# EasyEDA Pro project STM32单片机最小系统板2024-08-02.eprj

# Schematic Schematic1
Create Date: 2024-08-02; Page Name: P1; Project Name: STM32单片机最小系统板2024-08-02; Schematic Name: Schematic1; Update Date: 2024-08-03; Company: 嘉立创EDA; Page Size: A4; Version: V1.0
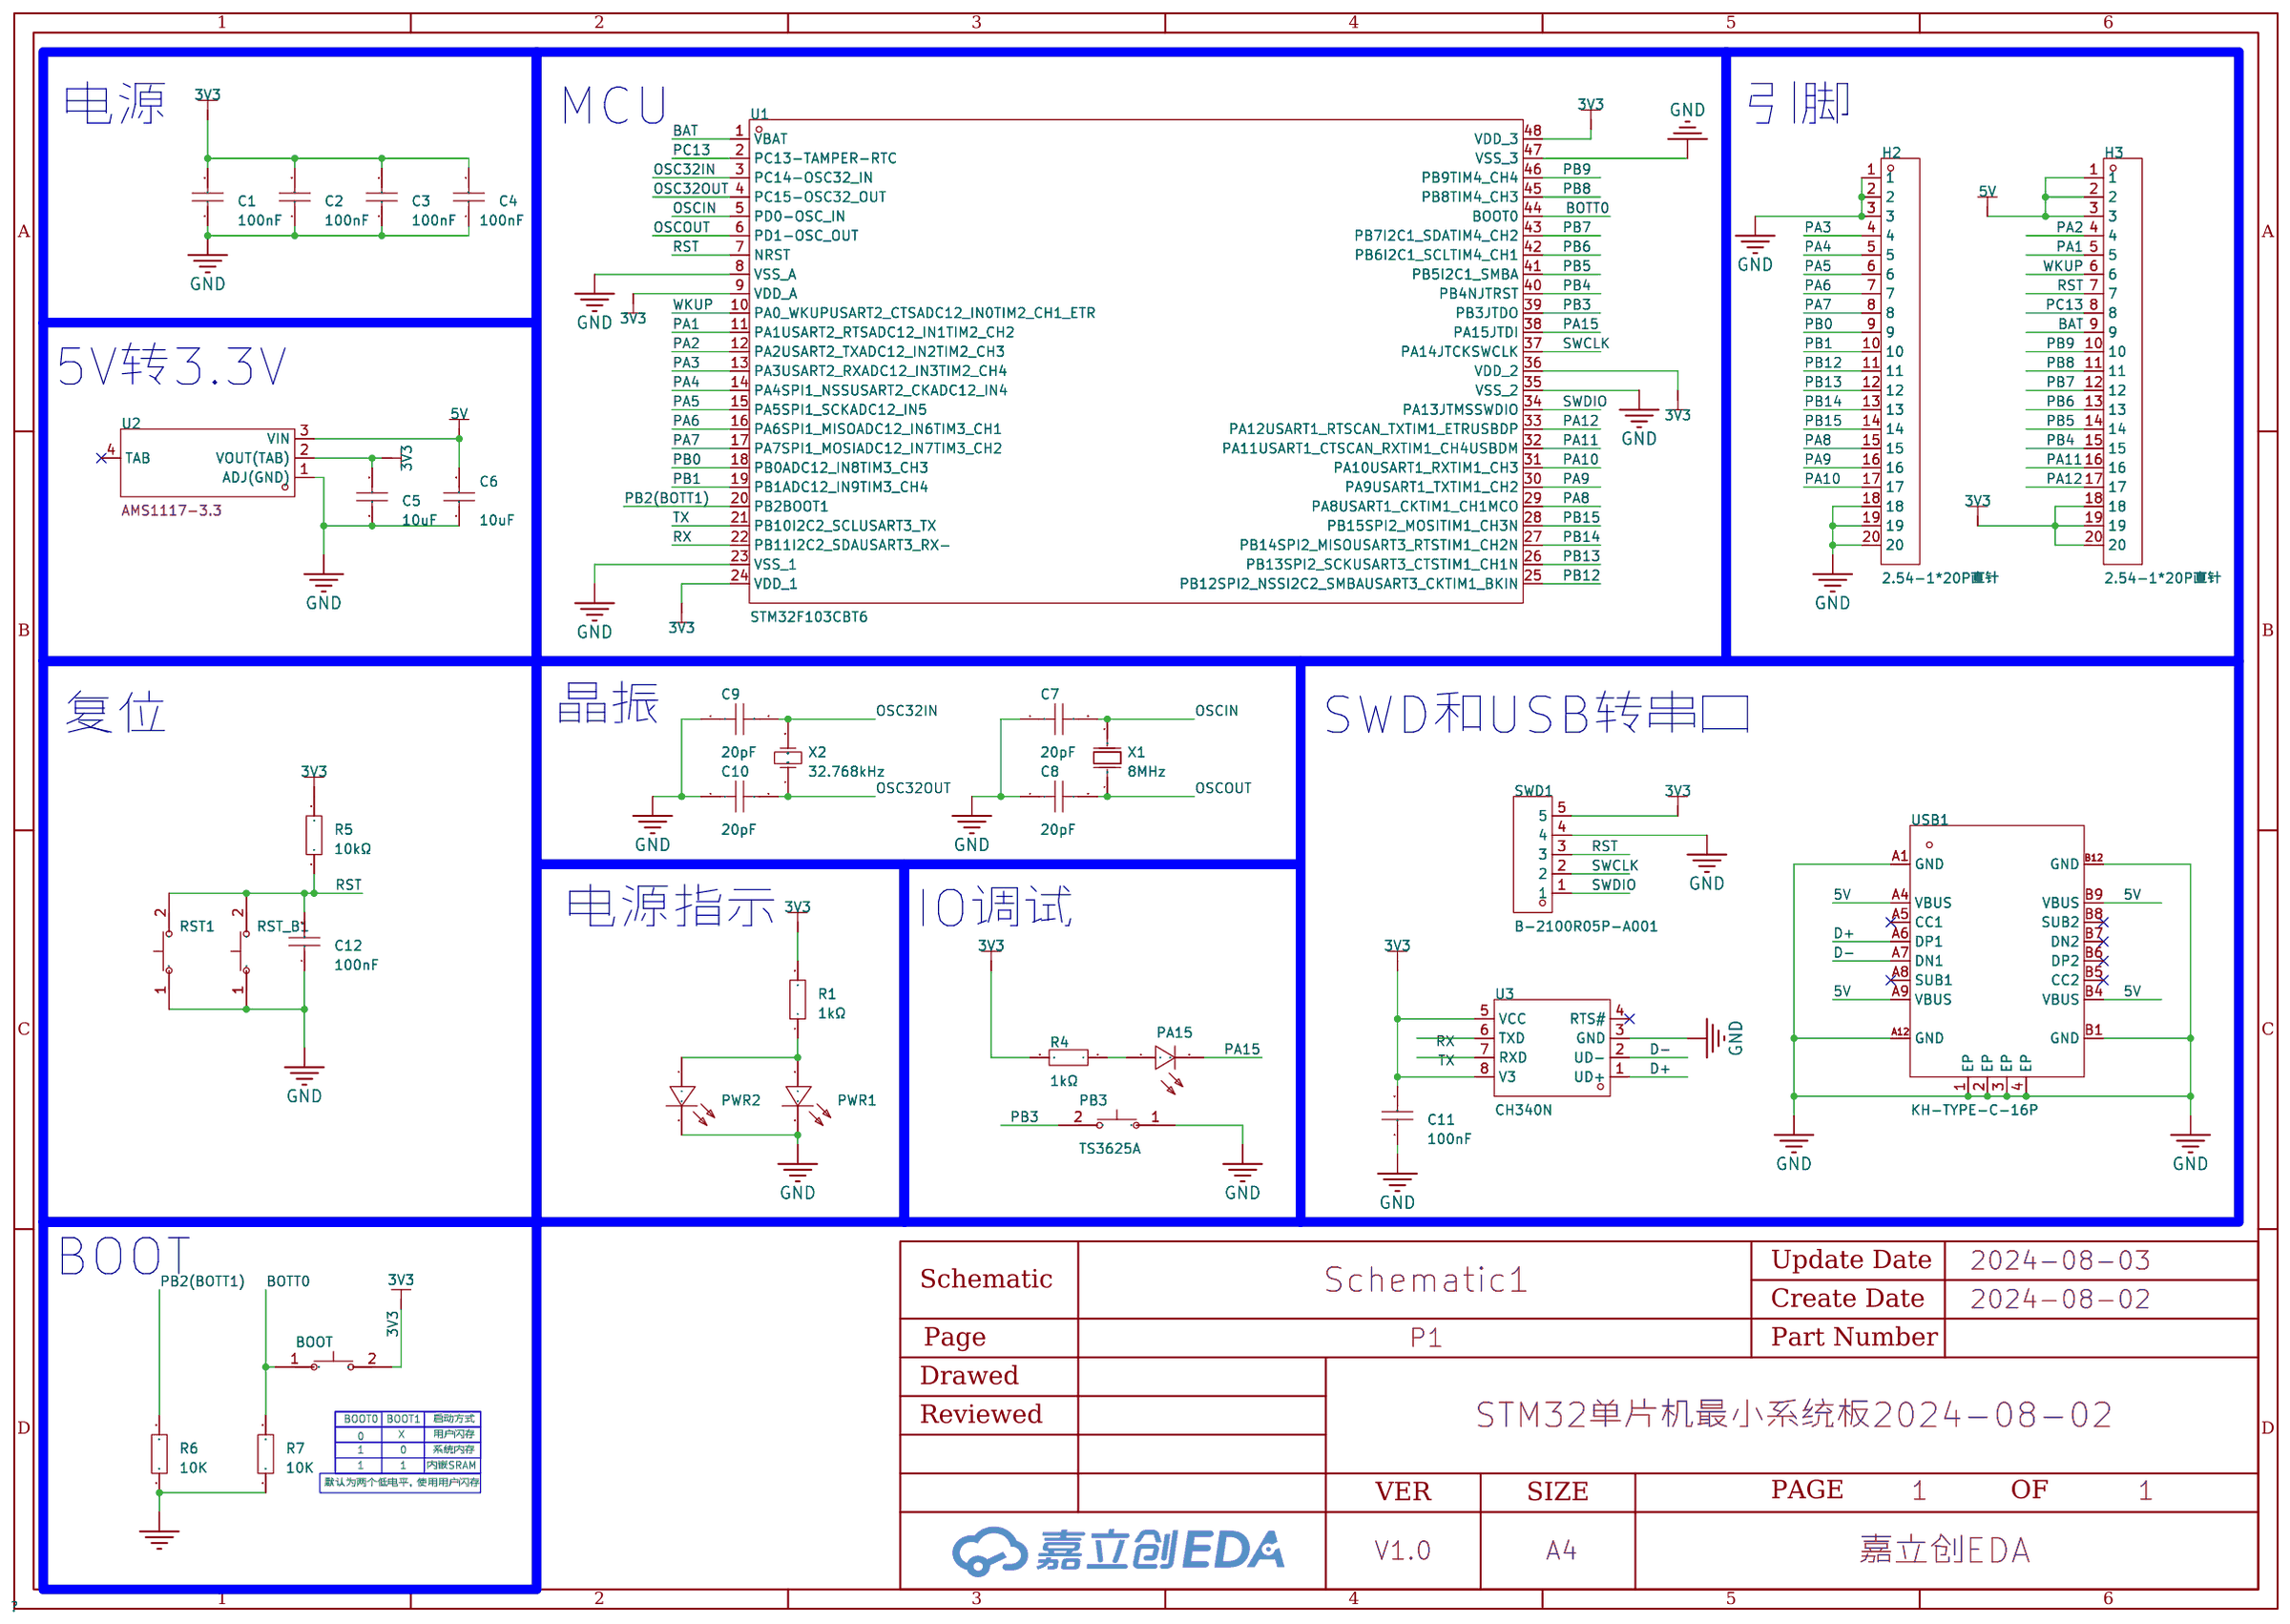
[diagram p0: schematic sheet]

## Parts
BOOT  TS3625A  [KEY-SMD_L6.0-W3.5-LS8.4]
C1  100nF  [C0805]
C2  100nF  [C0805]
C3  100nF  [C0805]
C4  100nF  [C0805]
C5  10uF  [C0805]
C6  10uF  [C0805]
C7  20pF  [C0805]
C8  20pF  [C0805]
C9  20pF  [C0805]
C10  20pF  [C0805]
C11  100nF  [C0805]
C12  100nF  [C0805]
H2  2.54-1*20P直针  [HDR-TH_20P-P2.54-V-M-1]
H3  2.54-1*20P直针  [HDR-TH_20P-P2.54-V-M-1]
PA15  NCD0805G1  [LED0805-R-RD]
PB3  TS3625A  [KEY-SMD_L6.0-W3.5-LS8.4]
PWR1  NCD0805G1  [LED0805-R-RD]
PWR2  NCD0805G1  [LED0805-R-RD]
R1  1kΩ  [R0805]
R4  1kΩ  [R0805]
R5  10kΩ  [R0805]
R6  10K  [R0603]
R7  10K  [R0603]
RST1  TS3625A  [KEY-SMD_L6.0-W3.5-LS8.4]
RST_B1  TS3625A  [KEY-SMD_L6.0-W3.5-LS8.4]
SWD1  B-2100R05P-A001  [HDR-TH_5P-P2.54-H-M-W6.0]
U1  STM32F103CBT6  [LQFP-48_L7.0-W7.0-P0.50-LS9.0-BL]
U2  AMS1117-3.3  [SOT-223-3_L6.5-W3.4-P2.30-LS7.0-BR]
U3  CH340N  [SOP-8_L4.9-W3.9-P1.27-LS6.0-BL]
USB1  KH-TYPE-C-16P  [USB-C-SMD_KH-TYPE-C-16P]
X1  8MHz  [OSC-SMD_4P-L3.2-W2.5-BL]
X2  32.768kHz  [FC-135R_L3.2-W1.5]

## Library data of the parts
BOOT PB3 RST1 RST_B1 = TS3625A: 触点电流:50mA;额定电压(DC):12V;电路结构:单刀单掷;安装方式:立贴;按钮形状:矩形按钮;带灯:-;作用力:250gf@±50gf;开关长度:6.1mm;开关宽度:3.65mm;开关高度:2.5mm;; LCSC Part Name: 轻触开关 3*6*2.5mm 250gf 拉伸款; Supplier Part: C398053; Manufacturer: SHOU HAN(首韩); Supplier Footprint: SMD; JLCPCB Part Class: Extended Part; Datasheet: https://atta.szlcsc.com/upload/public/pdf/source/20190620/C398053_EFFFB524A3F966B1F45EE8333D1EDECC.pdf; Supplier: LCSC; Contact Current: 50mA; Voltage Rating (DC): 12V; Circuit: 单刀单掷; Mounting Style: 立贴; Actuator Style: 矩形按钮; Operating Force: 250gf@±50gf; Switch Length: 6.1mm; Switch Width: 3.65mm; Switch Height: 2.5mm
C1-C4 C11 C12 = 0805B104K500NT: 温度系数:X7R;容值:100nF;精度:±10%;额定电压:50V;; LCSC Part Name: 100nF ±10% 50V; Supplier Part: C38141; Manufacturer: FH(风华); Supplier Footprint: 0805; JLCPCB Part Class: Extended Part; Datasheet: https://atta.szlcsc.com/upload/public/pdf/source/20170923/C38141_1506149447419988747.pdf; Supplier: LCSC; Temperature Coefficient: X7R; Tolerance: ±10%; Voltage Rated: 50V
C5 C6 = 0805X106K250NT: 容值:10uF;精度:±10%;额定电压:25V;材质(温度系数):X5R;; LCSC Part Name: 10uF ±10% 25V; Supplier Part: C40894; Manufacturer: FH(风华); Supplier Footprint: 0805; JLCPCB Part Class: Extended Part; Datasheet: https://atta.szlcsc.com/upload/public/pdf/source/20170923/C40894_1506149452994988759.pdf; Supplier: LCSC; Tolerance: ±10%; Voltage Rated: 25V; Temperature Coefficient: X5R
C7-C10 = 0805CG200J500NT: 容值:20pF;精度:±5%;额定电压:50V;材质(温度系数):C0G;; LCSC Part Name: 20pF ±5% 50V; Supplier Part: C94472; Manufacturer: FH(风华); Supplier Footprint: 0805; JLCPCB Part Class: Extended Part; Datasheet: https://atta.szlcsc.com/upload/public/pdf/source/20170923/C94472_1506149578159988997.pdf; Supplier: LCSC; Tolerance: ±5%; Voltage Rated: 50V; Temperature Coefficient: C0G
H2 H3 = 2.54-1*20P直针: 排数:单排;总PIN位数:20;间距:2.54mm;插针结构:1x20P;行距:-;安装类型:直插;圆针/方针:方针;额定电流:3A;额定电压:-;配合针长度:-;塑高:-;端接针长度:-;触头材质:黄铜;触头镀层:-;工作温度范围:-40℃~+105℃;颜色:黑色;; LCSC Part Name: 2.54mm 1x20P 直插 方针; Supplier Part: C50981; Manufacturer: BOOMELE(博穆精密); Supplier Footprint: 插件,P=2.54mm; JLCPCB Part Class: Extended Part; Datasheet: https://atta.szlcsc.com/upload/public/pdf/source/20151109/1457707571495.pdf; Supplier: LCSC; Number of Rows: 单排; Number of Pins: 20; Pitch: 2.54mm; Pin Structure: 1x20P; Mounting Type: 直插; Circluar Pins/Square Pins: 方针; Current Rating (Max): 3A; Contact Material: 黄铜; Operating Temperature Range: -40℃~+105℃; Color: 黑色
PA15 = NCD0805G1: 发光颜色:翠绿;; LCSC Part Name: 翠绿; Supplier Part: C84260; Manufacturer: 国星光电; Supplier Footprint: 0805; JLCPCB Part Class: Extended Part; Datasheet: https://atta.szlcsc.com/upload/public/pdf/source/20200820/C84260_AFC7BF57C6FBA034D182BB8D10A67EFE.pdf; Supplier: LCSC; Mounting Type: 表面贴装; Illumination Color: 翠绿; Luminous Intensity (IF=20mA): 180~400mcd@5mA; Dominant Wavelength / Coordinate rank: 525~537.5nm; Emitted Color: 翠绿; Lens Color: 无色透明; Dominant Wavelength: 624nm; Peak Wavelength: 632nm; Forward Current: 20mA; Forward Voltage (VF): 2V; Luminous Intensity: 61mcd; Power Dissipation: 60mW; Viewing Angle: 140°; Mounting Sytle: 正贴; Operating Temperature: -40℃~+85℃
PWR1 PWR2 = NCD0805G1: 照明颜色:翠绿;色温 - CCT（K）:-;主波长/色坐标:525~537.5nm;; LCSC Part Name: 翠绿 0805 贴片LED; Supplier Part: C84260; Manufacturer: 国星光电; Supplier Footprint: 0805; JLCPCB Part Class: Extended Part; Datasheet: https://atta.szlcsc.com/upload/public/pdf/source/20200820/C84260_AFC7BF57C6FBA034D182BB8D10A67EFE.pdf; Supplier: LCSC; Mounting Type: 表面贴装; Illumination Color: 翠绿; Luminous Intensity (IF=20mA): 180~400mcd@5mA; Dominant Wavelength / Coordinate rank: 525~537.5nm
R1 R4 = 0805W8F1001T5E: 精度:±1%;功率:125mW;电阻类型:厚膜电阻;最大工作电压:150V;温度系数:±100ppm/℃;工作温度范围:-55℃~+155℃;阻值:1kΩ;; LCSC Part Name: 1kΩ ±1%; Supplier Part: C17513; Manufacturer: UNI-ROYAL(厚声); Supplier Footprint: 0805; JLCPCB Part Class: Basic Part; Datasheet: https://atta.szlcsc.com/upload/public/pdf/source/20200306/C422600_1E6D84923E4A46A82E41ADD87F860B5C.pdf; Supplier: LCSC; Tolerance: ±1%; Power(Watts): 125mW; Type: 厚膜电阻; Overload Voltage (Max): 150V; Temperature Coefficient: ±100ppm/℃; Operating Temperature Range: -55℃~+155℃
R5 = 0805W8F1002T5E_C17414: 精度:±1%;温度系数:±100ppm/℃;阻值:10kΩ;功率:1/8W;最大工作电压:150V;工作温度范围:-55℃~+155℃;; LCSC Part Name: 10KΩ ±1%; Supplier Part: C17414; Manufacturer: UNI-ROYAL(厚声); Manufacturer Part: 0805W8F1002T5E; Supplier Footprint: 0805; JLCPCB Part Class: Basic Part; Datasheet: https://atta.szlcsc.com/upload/public/pdf/source/20170920/C17414_1505887067106979773.pdf; Supplier: LCSC; Tolerance: ±1%; Temperature Coefficient: ±100ppm/℃; Power(Watts): 1/8W; Overload Voltage (Max): 150V; Operating Temperature Range: -55℃~+155℃
R6 R7 = Res_0603: Supplier Footprint: 0603
SWD1 = B-2100R05P-A001: 排数:单排;总PIN位数:5;间距:2.54mm;插针结构:1x5P;行距:-;安装类型:弯插;圆针/方针:-;额定电流:-;额定电压:-;配合针长度:3mm;塑高:2.54mm;触头材质:黄铜;触头镀层:-;工作温度范围:-40℃~+105℃;颜色:黑色;; LCSC Part Name: 2.54mm 1x5P 弯插; Supplier Part: C379809; Manufacturer: Ckmtw(灿科盟); Supplier Footprint: 弯插,P=2.54mm; JLCPCB Part Class: Extended Part; Datasheet: https://atta.szlcsc.com/upload/public/pdf/source/20190517/C379809_8865E1FADBEE97C43FF553DFAF16A884.pdf; Supplier: LCSC; Number of Rows: 单排; Number of Pins: 5; Pitch: 2.54mm; Pin Structure: 1x5P; Mounting Type: 弯插; Length of Mating Pin: 3mm; Insulation Height: 2.54mm; Contact Material: 黄铜; Operating Temperature Range: -40℃~+105℃; Color: 黑色
U1 = STM32F103CBT6: 工作电压:2V ~ 3.6V;主频（MAX):72MHz;; Supplier Part: C8304; Manufacturer: ST(意法半导体); Supplier Footprint: LQFP-48_7x7x05P; JLCPCB Part Class: Basic Part; Datasheet: https://atta.szlcsc.com/upload/public/pdf/source/20140724/1457707170379.pdf; Supplier: LCSC; UART/USART: 3 USART; USB Device: 1; PWM: 13; I2C（SMBUS/PMBUS）: 2; Voltage - Supply (Vcc/Vdd): 2V ~ 3.6V; CAN: 1; A/D: 16x12bit; RAM Size: 20KB; Speed: 72MHz; Number of I/O: 37
U2 = AMS1117-3.3_C6186: 输出类型:固定;输出极性:正;最大输入电压:-;输出电压:3.3V;输出电流:1A;电源纹波抑制比(PSRR):72dB@(120Hz);; LCSC Part Name: 输出3.3V 1A; Supplier Part: C6186; Manufacturer: AMS; Supplier Footprint: SOT-223; JLCPCB Part Class: Basic Part; Datasheet: https://atta.szlcsc.com/upload/public/pdf/source/20180727/C6186_7A095716F0823C02F1997A905E26C086.pdf; Supplier: LCSC; Output Type: 固定; Output Polarity: 正; Number of Outputs: 1; Output Voltage: 3.3V; Dropout Voltage: 1.3V@(800mA); Output Current: 1A; Power Supply Rejection Ratio (PSRR): 72dB@(120Hz)
U3 = CH340N: LCSC Part Name: USB转串口芯片 CH340; Supplier Part: C2977777; Manufacturer: WCH(南京沁恒); Supplier Footprint: SOP-8; JLCPCB Part Class: Extended Part; Datasheet: https://atta.szlcsc.com/upload/public/pdf/source/20220223/82A45E4FF89B3EDCAD50B354450A7EF4.pdf; Supplier: LCSC
USB1 = KH-TYPE-C-16P: 连接器类型:Type-C;标准:-;公母:母座;触点数量:16;端口数量:1;安装方式:卧贴;额定电流 - 电源:3A;工作温度范围:-40℃~+85℃;; LCSC Part Name: Type-C 母座 卧贴; Supplier Part: C709357; Manufacturer: kinghelm(金航标); Supplier Footprint: SMD; JLCPCB Part Class: Extended Part; Datasheet: https://atta.szlcsc.com/upload/public/pdf/source/20200911/C709357_AA8DCEB38BB20E3035A7ED7AE7667837.pdf; Supplier: LCSC; Connector Type: Type-C; Gender: 母座; Number of Contacts: 16; Number of Ports: 1; Mounting Style: 卧贴; Current Rating - Power (Max): 3A; Operating Temperature Range: -40℃~+85℃
X1 = X32258MOB4SI: 频率:8MHz;频率公差:±10ppm;频率稳定度:±30ppm;负载电容:12pF;; LCSC Part Name: 8MHz ±10ppm 12pF; Supplier Part: C2682775; Manufacturer: YXC(扬兴晶振); Supplier Footprint: SMD3225-4P; JLCPCB Part Class: Extended Part; Datasheet: https://atta.szlcsc.com/upload/public/pdf/source/20210106/C2682774_0CD4FDA5D9DA3FBEEC23BD607A48E4B0.pdf; Supplier: LCSC; Crystal Type: 贴片无源晶振; Frequency Tolerance: ±10ppm; Frequency Stability: ±30ppm; Load Capacitance: 12pF; Equivalent Series Resistance (ESR): 150Ω; Operating Temperature: -40℃~+85℃
X2 = Q13FC1350000400: 频率:32.768kHz;频率公差:±20ppm;负载电容:12.5pF;; LCSC Part Name: 32.768kHz ±20ppm 12.5pF; Supplier Part: C32346; Manufacturer: EPSON(爱普生); Supplier Footprint: SMD3215-2P; JLCPCB Part Class: Basic Part; Datasheet: https://atta.szlcsc.com/upload/public/pdf/source/20190108/C32346_746D6B07EAF90824457A96480007685F.pdf; Supplier: LCSC; Crystal Type: 贴片无源晶振; Frequency Tolerance: ±20ppm; Load Capacitance: 12.5pF; Equivalent Series Resistance (ESR): 70kΩ; Operating Temperature: -40℃~+85℃

## Nets
3V3: BOOT.2 C1.2 C2.2 C3.2 C4.2 C5.2 C11.2 H3.18 H3.19 H3.20 R1.2 R4.2 R5.2 SWD1.5 U1.9(VDD_A) U1.24(VDD_1) U1.36(VDD_2) U1.48(VDD_3) U2.2(VOUT(TAB)) U3.5(VCC) U3.8(V3)
5V: C6.2 H3.1 H3.2 H3.3 U2.3(VIN) USB1.A4(VBUS) USB1.A9(VBUS) USB1.B4(VBUS) USB1.B9(VBUS)
GND: C1.1 C2.1 C3.1 C4.1 C5.1 C6.1 C7.1 C8.1 C9.1 C10.1 C11.1 C12.1 H2.1 H2.2 H2.3 H2.18 H2.19 H2.20 PB3.1 PWR1.2(K) PWR2.2(K) R6.1 R7.1 RST1.1 RST_B1.1 SWD1.4 U1.8(VSS_A) U1.23(VSS_1) U1.35(VSS_2) U1.47(VSS_3) U2.1(ADJ(GND)) U3.3(GND) USB1.1(EP) USB1.2(EP) USB1.3(EP) USB1.4(EP) USB1.A1(GND) USB1.A12(GND) USB1.B1(GND) USB1.B12(GND)
BAT: H3.9 U1.1(VBAT)
BOTT0: BOOT.1 R7.2 U1.44(BOOT0)
D+: U3.1(UD+) USB1.A6(DP1)
D-: U3.2(UD-) USB1.A7(DN1)
OSC32IN: C9.2 U1.3(PC14-OSC32_IN) X2.2(OSC2)
OSC32OUT: C10.2 U1.4(PC15-OSC32_OUT) X2.1(OSC1)
OSCIN: C7.2 U1.5(PD0-OSC_IN) X1.2(OSC2)
OSCOUT: C8.2 U1.6(PD1-OSC_OUT) X1.1(OSC1)
PA1: H3.5 U1.11(PA1USART2_RTSADC12_IN1TIM2_CH2)
PA2: H3.4 U1.12(PA2USART2_TXADC12_IN2TIM2_CH3)
PA3: H2.4 U1.13(PA3USART2_RXADC12_IN3TIM2_CH4)
PA4: H2.5 U1.14(PA4SPI1_NSSUSART2_CKADC12_IN4)
PA5: H2.6 U1.15(PA5SPI1_SCKADC12_IN5)
PA6: H2.7 U1.16(PA6SPI1_MISOADC12_IN6TIM3_CH1)
PA7: H2.8 U1.17(PA7SPI1_MOSIADC12_IN7TIM3_CH2)
PA8: H2.15 U1.29(PA8USART1_CKTIM1_CH1MCO)
PA9: H2.16 U1.30(PA9USART1_TXTIM1_CH2)
PA10: H2.17 U1.31(PA10USART1_RXTIM1_CH3)
PA11: H3.16 U1.32(PA11USART1_CTSCAN_RXTIM1_CH4USBDM)
PA12: H3.17 U1.33(PA12USART1_RTSCAN_TXTIM1_ETRUSBDP)
PA15: PA15.2(C) U1.38(PA15JTDI)
PB0: H2.9 U1.18(PB0ADC12_IN8TIM3_CH3)
PB1: H2.10 U1.19(PB1ADC12_IN9TIM3_CH4)
PB2(BOTT1): R6.2 U1.20(PB2BOOT1)
PB3: PB3.2 U1.39(PB3JTDO)
PB4: H3.15 U1.40(PB4NJTRST)
PB5: H3.14 U1.41(PB5I2C1_SMBA)
PB6: H3.13 U1.42(PB6I2C1_SCLTIM4_CH1)
PB7: H3.12 U1.43(PB7I2C1_SDATIM4_CH2)
PB8: H3.11 U1.45(PB8TIM4_CH3)
PB9: H3.10 U1.46(PB9TIM4_CH4)
PB12: H2.11 U1.25(PB12SPI2_NSSI2C2_SMBAUSART3_CKTIM1_BKIN)
PB13: H2.12 U1.26(PB13SPI2_SCKUSART3_CTSTIM1_CH1N)
PB14: H2.13 U1.27(PB14SPI2_MISOUSART3_RTSTIM1_CH2N)
PB15: H2.14 U1.28(PB15SPI2_MOSITIM1_CH3N)
PC13: H3.8 U1.2(PC13-TAMPER-RTC)
RST: C12.2 H3.7 R5.1 RST1.2 RST_B1.2 SWD1.3 U1.7(NRST)
RX: U1.22(PB11I2C2_SDAUSART3_RX-) U3.6(TXD)
SWCLK: SWD1.2 U1.37(PA14JTCKSWCLK)
SWDIO: SWD1.1 U1.34(PA13JTMSSWDIO)
TX: U1.21(PB10I2C2_SCLUSART3_TX) U3.7(RXD)
WKUP: H3.6 U1.10(PA0_WKUPUSART2_CTSADC12_IN0TIM2_CH1_ETR)
$1N16984: PA15.1(A) R4.1
$1N20944: PWR1.1(A) PWR2.1(A) R1.1

Not connected (* = marked no-connect by the designer): U2 4(TAB)*; U3 4(RTS#)*; USB1 A5(CC1)* A8(SUB1)* B5(CC2)* B6(DP2)* B7(DN2)* B8(SUB2)*

## Notes on the sheet
- 电源
- MCU
- 引脚
- 5V转3.3V
- 晶振
- 复位
- SWD和USB转串口
- 电源指示
- IO调试
- BOOT
- BOOT0
- BOOT1
- X
- 启动方式
- 用户闪存
- 0
- 1
- 0
- 系统内存
- 1
- 1
- 内嵌SRAM
- 默认为两个低电平，使用用户闪存

# Board PCB1
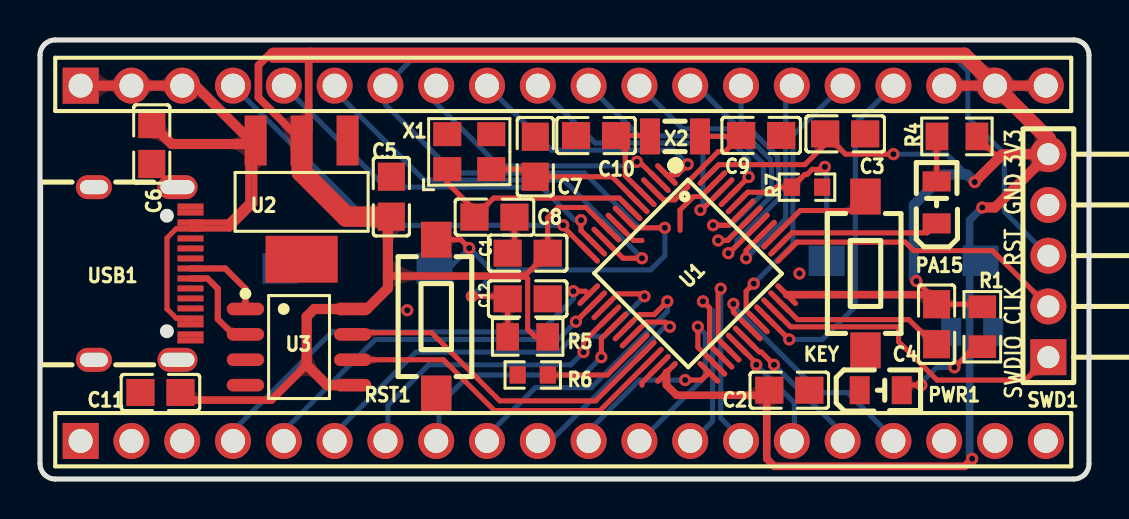
[diagram p1: board, top side]
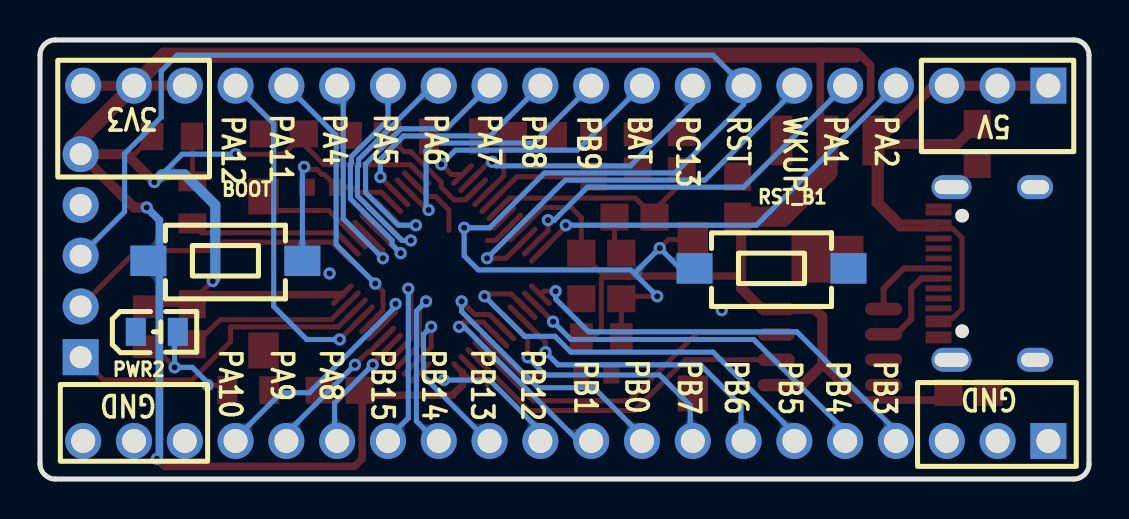
[diagram p2: board, bottom side, seen from below]

Outline 52.45 x 21.97 mm; copper layers: Top Layer, Bottom Layer. Coordinates in mm from the lower left corner of the outline.
Outline path: 0,21.21 0,0.76 arc(0.22,0.22) 0.76,0 51.69,0 arc(52.23,0.22) 52.45,0.76 52.45,21.21 arc(52.23,21.75) 51.69,21.97 0.76,21.97 arc(0.22,21.75) 0,21.21
Stack: Top Layer 0.035mm / Dielectric1 1.51mm FR4 er 4.5 / Bottom Layer 0.035mm

## Design rules (mm)
template: JLCPCB Capability(Two Layers Board)
spacing copperThickness1oz (default): track to track 0.102, other pairs 0.152 to 0.3
spacing copperThickness2oz: track to track 0.203, other pairs 0.152 to 0.3
track width copperThickness1oz (default): min 0.127, default 0.254, max 2.54
track width copperThickness2oz: min 0.203, default 0.254, max 2.54
differential pair differentialPair (default): width min 0.127, default 0.254, max 2.54; gap min 0.152, default 0.152
via viaSize (default): diameter min 0.5, default 0.61, max 10; hole min 0.3, default 0.305, max 6.3

## Placement (name value [footprint] x y rotation side)
BOOT  TS3625A  [KEY-SMD_L6.0-W3.5-LS8.4]  43.18 10.92 0 bottom
C1  100nF  [C0805]  24.38 11.3 0 top
C2  100nF  [C0805]  37.47 4.44 180 top
C3  100nF  [C0805]  40.26 17.27 180 top
C4  100nF  [C0805]  44.83 7.75 90 top
C5  10uF  [C0805]  17.57 14.13 270 top
C6  10uF  [C0805]  5.59 16.76 90 top
C7  20pF  [C0805]  24.77 16.13 270 top
C8  20pF  [C0805]  22.72 13.11 180 top
C9  20pF  [C0805]  36.06 17.19 180 top
C10  20pF  [C0805]  27.8 17.19 0 top
C11  100nF  [C0805]  6.02 4.33 0 top
C12  100nF  [C0805]  24.38 9.02 180 top
H2  2.54-1*20P直针  [HDR-TH_20P-P2.54-V-M-1]  26.16 1.9 0 top
H3  2.54-1*20P直针  [HDR-TH_20P-P2.54-V-M-1]  26.16 19.68 0 top
KEY  TS3625A  [KEY-SMD_L6.0-W3.5-LS8.4]  41.27 10.29 90 top
PA15  NCD0805G1  [LED0805-R-RD]  44.83 13.84 90 top
PWR1  NCD0805G1  [LED0805-R-RD]  42.04 4.44 0 top
PWR2  NCD0805G1  [LED0805-R-RD]  46.61 7.37 180 bottom
R1  1kΩ  [R0805]  47.12 7.62 90 top
R4  1kΩ  [R0805]  45.85 17.14 0 top
R5  10kΩ  [R0805]  24.38 7.11 0 top
R6  10K  [R0603]  24.64 5.21 0 top
R7  10K  [R0603]  38.35 14.6 180 top
RST1  TS3625A  [KEY-SMD_L6.0-W3.5-LS8.4]  19.81 8.13 90 top
RST_B1  TS3625A  [KEY-SMD_L6.0-W3.5-LS8.4]  15.88 10.54 0 bottom
SWD1  B-2100R05P-A001  [HDR-TH_5P-P2.54-H-M-W6.0]  50.42 11.18 90 top
U1  STM32F103CBT6  [LQFP-48_L7.0-W7.0-P0.50-LS9.0-BL]  32.39 10.29 225 top
U2  AMS1117-3.3  [SOT-223-3_L6.5-W3.4-P2.30-LS7.0-BR]  13.08 13.97 90 top
U3  CH340N  [SOP-8_L4.9-W3.9-P1.27-LS6.0-BL]  12.95 6.6 270 top
USB1  KH-TYPE-C-16P  [USB-C-SMD_KH-TYPE-C-16P]  5.11 10.29 270 top
X1  8MHz  [OSC-SMD_4P-L3.2-W2.5-BL]  21.46 16.38 0 top
X2  32.768kHz  [FC-135R_L3.2-W1.5]  31.75 17.14 0 top

## Footprints (pads in the part's own frame, mm; a bottom-side part is the same pattern mirrored in y, then rotated)
C0805
  rect 1.41x1.35 smd: 1(-1,0) 2(1,0)
FC-135R_L3.2-W1.5
  rect 1x1.8 smd: 1(-1.25,0) 2(1.25,0)
HDR-TH_5P-P2.54-H-M-W6.0
  rect 1.8x1.8 hole 1.1: 1(-5.08,0)
  round 1.8 hole 1.1: 2(-2.54,0) 3(0,0) 4(2.54,0) 5(5.08,0)
HDR-TH_20P-P2.54-V-M-1
  rect 1.8x1.8 hole 1.2: 1(-24.13,0)
  round 1.8 hole 1.2: 2(-21.59,0) 3(-19.05,0) 4(-16.51,0) 5(-13.97,0) 6(-11.43,0) 7(-8.89,0) 8(-6.35,0) 9(-3.81,0) 10(-1.27,0) 11(1.27,0) 12(3.81,0) 13(6.35,0) 14(8.89,0) 15(11.43,0) 16(13.97,0) 17(16.51,0) 18(19.05,0) 19(21.59,0) 20(24.13,0)
KEY-SMD_L6.0-W3.5-LS8.4
  rect 1.8x1.524 smd: 1(-3.85,0) 2(3.85,0)
LED0805-R-RD
  rect 1x1.399 smd: 1(1.05,0) 2(-1.05,0)
LQFP-48_L7.0-W7.0-P0.50-LS9.0-BL
  oval 0.27x1.5 smd: 1(-2.75,-4.25) 2(-2.25,-4.25) 3(-1.75,-4.25) 4(-1.25,-4.25) 5(-0.75,-4.25) 6(-0.25,-4.25) 7(0.25,-4.25) 8(0.75,-4.25) 9(1.25,-4.25) 10(1.75,-4.25) 11(2.25,-4.25) 12(2.75,-4.25) 25(2.75,4.25) 26(2.25,4.25) 27(1.75,4.25) 28(1.25,4.25) 29(0.75,4.25) 30(0.25,4.25) 31(-0.25,4.25) 32(-0.75,4.25) 33(-1.25,4.25) 34(-1.75,4.25) 35(-2.25,4.25) 36(-2.75,4.25)
  oval 1.5x0.27 smd: 13(4.25,-2.75) 14(4.25,-2.25) 15(4.25,-1.75) 16(4.25,-1.25) 17(4.25,-0.75) 18(4.25,-0.25) 19(4.25,0.25) 20(4.25,0.75) 21(4.25,1.25) 22(4.25,1.75) 23(4.25,2.25) 24(4.25,2.75) 37(-4.25,2.75) 38(-4.25,2.25) 39(-4.25,1.75) 40(-4.25,1.25) 41(-4.25,0.75) 42(-4.25,0.25) 43(-4.25,-0.25) 44(-4.25,-0.75) 45(-4.25,-1.25) 46(-4.25,-1.75) 47(-4.25,-2.25) 48(-4.25,-2.75)
OSC-SMD_4P-L3.2-W2.5-BL
  rect 1.4x1.2 smd: 1(-1.1,-0.875) 2(1.1,-0.875) 3(1.1,0.875) 4(-1.1,0.875)
R0603
  rect 0.806x0.864 smd: 1(-0.753,0) 2(0.753,0)
R0805
  rect 1.133x1.377 smd: 1(-1,0) 2(1,0)
SOP-8_L4.9-W3.9-P1.27-LS6.0-BL
  oval 0.63x1.865 smd: 1(-1.905,-2.683) 2(-0.635,-2.683) 3(0.635,-2.683) 4(1.905,-2.683) 5(1.905,2.683) 6(0.635,2.683) 7(-0.635,2.683) 8(-1.905,2.683)
SOT-223-3_L6.5-W3.4-P2.30-LS7.0-BR
  rect 2.5x1.1 smd: 1(2.97,-2.3) 2(2.97,0) 3(2.97,2.3)
  rect 2.34x3.6 smd: 4(-2.97,0)
USB-C-SMD_KH-TYPE-C-16P
  oval 1.2x2 hole 0.7x1.7: 1(-4.32,1.765) 2(4.32,1.765)
  oval 1.2x1.8 hole 0.7x1.4: 3(-4.32,-2.415) 4(4.32,-2.415)
  rect 0.3x1.3 smd: A1(-3.35,2.415) A4(-2.55,2.415) A5(-1.25,2.415) A6(-0.25,2.415) A7(0.25,2.415) A8(1.25,2.415) A9(2.55,2.415) A12(3.35,2.415) B1(3.05,2.415) B4(2.25,2.415) B5(1.75,2.415) B6(0.75,2.415) B7(-0.75,2.415) B8(-1.75,2.415) B9(-2.25,2.415) B12(-3.05,2.415)

## Nets
As in the schematic, except:
GND: C1.1 C2.1 C3.1 C4.1 C5.1 C6.1 C7.1 C8.1 C9.1 C10.1 C11.1 C12.1 H2.1 H2.2 H2.3 H2.18 H2.19 H2.20 KEY.1 PWR1.2 PWR2.2 R6.1 R7.1 RST1.1 RST_B1.1 SWD1.4 U1.8 U1.23 U1.35 U1.47 U2.1 U3.3 USB1.1 USB1.2 USB1.3 USB1.4 USB1.A1 USB1.A12 USB1.B1 USB1.B12
PB3: KEY.2 U1.39

Pads without a net: U2 4; U3 4; USB1 A5 A8 B5 B6 B7 B8; X1 3 4

## Via types
v1: diameter 0.61, hole 0.305, Top Layer to Bottom Layer, 40 vias

## Routing (per net, layer and track width the routed paths; a pad name or vN(x,y) marks a point on that pad's centre or on a via; arc(x,y) is an arc through that point)
3V3: length 179.1
  Top Layer w0.254: 48.13,16.26 47.74,16.26 R4.2 ; 24.25,10.17 C1.2 25.38,13.08 25.89,13.59 27.3,13.59 28.49,12.41 U1.9 ; v1(43.82,9.91) 44.83,8.89 C4.2 46.99,8.75 R1.2 ; v1(42.67,16.26) 40.27,16.26 C3.2 39.26,16.75 38.24,15.73 33.94,15.73 U1.48 ; 24.26,10.16 24.38,10.03 24.38,7.49 24.77,7.11 R5.2
  Top Layer w0.381: U1.36 44.35,9.23 C4.2 ; U1.24 31.32,4.7 31.84,4.19 36.08,4.19 36.34,4.44 C2.2 36.34,4.32 36.34,1.02 36.72,0.63 46.23,0.63 v1(46.61,1.02) ; 24.26,10.16 17.45,10.16 17.4,10.1 ; 13.33,5.71 11.57,3.95 7.4,3.95 C11.2 ; 13.47,21.21 13.43,21.18 13.43,17.44 13.06,17.07 12.95,17.07 10.92,19.09 10.92,20.7 11.43,21.21
  Top Layer w0.508: H3.20 H3.19 H3.18 ; U3.5 14.35,4.7 13.33,5.71 13.33,8.13 13.72,8.51 U3.8 16.36,8.51 17.4,9.55 17.4,12.96 C5.2 ; v1(46.74,14.86) 48.13,16.26 SWD1.5 47.75,13.59 v1(47.12,13.59)
  Top Layer w0.762: 11.68,21.21 46.23,21.21 H3.19 50.42,17.02 SWD1.5
  Top Layer w1.016: C5.2 15.32,13.13 13.08,15.37 U2.2
  Bottom Layer w0.254: v1(42.67,16.26) 45.34,16.26 46.36,15.24
  Bottom Layer w0.381: v1(47.12,13.59) 46.48,12.95 46.48,1.14 v1(46.61,1.02)
  Bottom Layer w0.508: v1(43.82,9.91) 43.69,10.03 43.69,13.72 45.21,15.24 46.36,15.24 v1(46.74,14.86)
5V: length 34.6
  Top Layer w0.254: USB1.A9 7.22,8.04 6.82,8.04 6.35,8.51 6.35,12.06 6.82,12.54 USB1.B9
  Top Layer w0.305: USB1.A4 9.41,12.84 10.41,13.84 10.41,16.54 10.59,16.71 10.72,16.59 10.72,13.77 9.49,12.54 USB1.B9
  Top Layer w0.508: 6.92,19.56 6.8,19.68 H3.2 H3.1 ; H3.3 7.77,19.68 10.65,16.8 10.61,16.76 6.59,16.76 C6.2
GND: length 17
  Top Layer w0.254: 32,12.45 32,13.46 32.68,14.14 33.05,14.14 U1.47 ; C8.1 23.72,11.64 C1.1 ; 30.1,11.94 29.67,11.94 28.85,12.76 ; 36.98,8.87 37.88,7.98 43.45,7.98 44.68,6.75 C4.1 ; 30.1,4.7 30.1,4.82 30.97,5.69
  vias: v1(18.36,8.45) v1(37.97,10.29)
BAT: length 12.9
  Top Layer w0.254: U1.1 31.87,15.24 v1(32.39,15.75)
  Bottom Layer w0.254: H3.9 25.58,16.46 31.67,16.46 v1(32.39,15.75)
BOTT0: length 9.9
  Top Layer w0.254: v1(39.24,15.62) 39.12,15.49 38.61,15.49 38.35,15.24 38.24,15.24 R7.2 36.83,14.6 36.58,14.35 35.39,14.35 U1.44
  Bottom Layer w0.254: v1(39.24,15.62) 39.33,15.53 BOOT.1
D+: length 4.2
  Top Layer w0.305: USB1.A6 9.26,10.54 10.27,9.52 U3.1
D-: length 4.8
  Top Layer w0.305: U3.2 9.65,7.24 8.89,8 8.89,9.52 8.38,10.04 USB1.A7
OSC32IN: length 8.2
  Top Layer w0.254: X2.2 35.01,17.14 ; 35.01,17.14 34.25,16.38 33.91,16.38 32.39,14.86 32.39,14.6 31.75,13.97 31.18,13.97 U1.3 ; 35.01,17.14 C9.2
OSC32OUT: length 5.3
  Top Layer w0.254: 30.26,14.18 29.26,15.18 29.26,16.73 C10.2 30.46,17.19 X2.1
OSCIN: length 8
  Top Layer w0.254: U1.5 28.6,15.13 C7.2 24.39,15.51 X1.2
OSCOUT: length 11.4
  Top Layer w0.254: U1.6 28.97,14.06 22.68,14.06 C8.2 21.72,13.46 20.36,14.82 X1.1
PA1: length 19.2
  Top Layer w0.254: U1.11 27.05,12.44 v1(27.05,12.95)
  Bottom Layer w0.254: H3.5 17.27,14.6 25.08,14.6 26.73,12.95 v1(27.05,12.95)
PA2: length 21.3
  Top Layer w0.254: v1(26.16,12.7) 26.16,12.62 U1.12
  Bottom Layer w0.254: v1(26.16,12.7) 16.64,12.7 H3.4
PA3: length 21.7
  Top Layer w0.254: v1(26.67,9.4) 27.26,9.4 U1.13
  Bottom Layer w0.254: v1(26.67,9.4) 26.67,9.02 25.02,7.37 14.61,7.37 9.14,1.9
PA4: length 19
  Top Layer w0.254: v1(26.8,7.87) 27.04,8.12 27.04,8.13 U1.14
  Bottom Layer w0.254: v1(26.8,7.87) 25.91,6.98 16.76,6.98 11.68,1.9
PA5: length 21.3
  Top Layer w0.254: v1(30.23,9.14) 30.1,9.27 28.89,9.27 U1.15
  Bottom Layer w0.254: 14.35,1.9 18.8,6.35 25.91,6.35 26.7,7.14 28.23,7.14 v1(30.23,9.14)
PA6: length 15
  Top Layer w0.254: U1.16 28.49,8.17 27.18,6.86 v1(27.18,6.35)
  Bottom Layer w0.254: 17.4,1.9 17.4,3.68 19.43,5.71 26.54,5.71 v1(27.18,6.35)
PA7: length 12.9
  Top Layer w0.254: 28.85,7.81 28.07,7.03 v1(28.07,6.1)
  Bottom Layer w0.254: 19.94,1.9 19.94,3.68 21.46,5.21 27.18,5.21 v1(28.07,6.1)
PA8: length 6
  Top Layer w0.254: v1(35.81,5.71) 35.81,5.8 U1.29
  Bottom Layer w0.254: 37.72,1.9 37.72,3.81 v1(35.81,5.71)
PA9: length 7.3
  Top Layer w0.254: v1(36.7,5.71) 36.06,6.36 35.96,6.36 U1.30
  Bottom Layer w0.254: v1(36.7,5.71) 40.26,2.16 40.26,1.9
PA10: length 12.7
  Top Layer w0.254: v1(34.67,8.76) 34.67,8.35 35.57,7.46
  Bottom Layer w0.254: 42.8,1.9 40.39,4.32 38.99,4.32 34.67,8.64 v1(34.67,8.76)
PA11: length 14.1
  Top Layer w0.254: v1(35.69,9.78) 35.31,9.4 35.31,8.43 35.92,7.81
  Bottom Layer w0.254: v1(35.69,9.78) 37.64,11.74 37.64,17.2 H3.16
PA12: length 17.5
  Top Layer w0.254: v1(37.47,6.98) 37.45,6.98 U1.33
  Bottom Layer w0.254: H3.17 40.77,17.78 40.77,8.64 39.12,6.98 v1(37.47,6.98)
PA15: length 8.3
  Top Layer w0.254: PA15.2 44.36,12.32 37.6,12.32 36.98,11.7
PB0: length 15.2
  Top Layer w0.254: v1(31.37,8.89) 30.71,8.23 29.97,8.23 U1.18
  Bottom Layer w0.254: 22.1,1.9 24.77,4.57 27.56,4.57 31.37,8.38 v1(31.37,8.89)
PB1: length 11.2
  Top Layer w0.254: v1(31.5,7.62) 31.26,7.85 30.3,7.85 U1.19
  Bottom Layer w0.254: 25.02,1.9 25.53,1.9 31.24,7.62 v1(31.5,7.62)
PB2(BOTT1): length 5.2
  Top Layer w0.254: 25.38,5.21 28.37,5.21 U1.20
PB3: length 5.5
  Top Layer w0.254: U1.39 38.01,13.44 40.57,13.44 KEY.2
PB4: length 11.3
  Top Layer w0.254: U1.40 35.31,11.44 v1(35.31,11.05)
  Bottom Layer w0.254: H3.15 37.29,19.38 37.29,13.03 v1(35.31,11.05)
PB5: length 12.3
  Top Layer w0.254: 35.92,12.76 34.46,11.3 v1(34.42,11.3)
  Bottom Layer w0.254: v1(34.42,11.3) 34.85,11.73 34.85,11.94 36.93,14.03 36.93,15.77 36.88,15.82 36.88,16.14 35.05,17.97 H3.14
PB6: length 13.1
  Top Layer w0.254: 35.57,13.12 34.39,11.94 v1(33.91,11.94)
  Bottom Layer w0.254: H3.13 32.83,19.68 36.53,15.99 36.53,15.67 36.58,15.62 36.58,14.17 34.34,11.94 v1(33.91,11.94)
PB7: length 14.3
  Top Layer w0.254: U1.43 34.44,12.7 v1(33.66,12.7)
  Bottom Layer w0.254: H3.12 32.13,17.53 34.41,17.53 36.17,15.77 36.17,14.33 34.54,12.7 v1(33.66,12.7)
PB8: length 11.7
  Top Layer w0.254: v1(35.43,15.11) 34.51,14.19 34.51,14.18
  Bottom Layer w0.254: H3.11 29.95,17.17 34.27,17.17 35.43,16 v1(35.43,15.11)
PB9: length 14.2
  Top Layer w0.254: U1.46 33.08,13.46 v1(33.02,13.46)
  Bottom Layer w0.254: v1(33.02,13.46) 33.15,13.59 33.15,16.43 32.77,16.81 27.76,16.81 H3.10
PB12: length 7.7
  Top Layer w0.254: v1(32.26,4.95) 33.06,4.95 U1.25
  Bottom Layer w0.254: v1(32.26,4.95) 29.97,4.95 27.56,2.54 27.56,1.9
PB13: length 9.4
  Top Layer w0.254: v1(32.89,7.62) 32.89,6.6 U1.26
  Bottom Layer w0.254: v1(32.89,7.62) 33.27,7.24 33.27,5.14 30.1,1.97
PB14: length 10.9
  Top Layer w0.254: U1.27 33.48,6.72 33.48,8.56 v1(33.15,8.89)
  Bottom Layer w0.254: 32.64,1.9 33.63,2.9 33.63,8.41 v1(33.15,8.89)
PB15: length 11.5
  Top Layer w0.254: 34.51,6.4 33.91,7 33.91,9.4 v1(34.04,9.52)
  Bottom Layer w0.254: v1(34.04,9.52) 34.04,3.05 35.18,1.9
PC13: length 13.8
  Top Layer w0.254: v1(29.85,15.88) 29.98,15.88 30.97,14.88
  Bottom Layer w0.254: v1(29.85,15.88) 29.64,15.67 22.94,15.67 19.81,18.8 H3.8
RST: length 82.1
  Top Layer w0.254: R5.1 C12.2 23.26,9.14 v1(21.59,9.14) ; v1(21.46,11.56) 21.04,11.98 RST1.2 ; v1(31.24,12.57) 29.75,12.57 U1.7
  Bottom Layer w0.254: 22.73,10.29 v1(21.46,11.56) 20.45,10.54 RST_B1.2 ; 22.73,10.29 v1(21.59,9.14) ; 22.73,10.29 22.91,10.46 30.53,10.46 31.24,11.18 v1(31.24,12.57) 29.97,12.57 27.23,15.32 20.69,15.32 17.27,18.73 H3.7 18.8,21.21 45.59,21.21 46.39,20.41 46.39,18.11 48.22,16.28 48.22,13.38 SWD1.3
RX: length 17.1
  Top Layer w0.254: U3.6 20.18,5.97 22.72,3.43 28,3.43 U1.22
SWCLK: length 14.6
  Top Layer w0.254: SWD1.2 47.63,11.43 43.69,11.43 43.26,11.86 37.84,11.86 U1.37
SWDIO: length 16.2
  Top Layer w0.254: SWD1.1 49.28,4.95 44.85,4.95 42.93,6.88 42.93,7.62 37.53,7.62 U1.34
TX: length 17.1
  Top Layer w0.254: U3.7 15.72,7.32 19.58,7.32 22.99,3.91 27.78,3.91 30.26,6.4
WKUP: length 21.2
  Top Layer w0.254: 28.36,11.84 29.15,11.05 v1(30.1,11.05)
  Bottom Layer w0.254: H3.6 14.73,19.43 19.2,14.96 26.19,14.96 v1(30.1,11.05)
$1N16984: length 2.3
  Top Layer w0.254: R4.1 44.83,17.13 PA15.1
$1N20944: length 6.8
  Top Layer w0.254: v1(45.72,5.59) 46.75,6.62 R1.1 ; PWR1.1 43.34,4.7 v1(44.07,4.7)
  Bottom Layer w0.254: PWR2.1 45.72,7.2 v1(45.72,5.59) 44.83,5.59 44.07,4.83 v1(44.07,4.7)

## Copper pours and planes (outline as drawn; the poured copper is in the pictures)
GND on Top Layer: -1.65,23.75 53.47,23.75 53.47,-1.14 -1.65,-1.14
GND on Bottom Layer: -0.89,23.24 53.09,23.24 53.09,-0.51 -0.89,-0.51

Small or netless copper shapes (teardrops, artwork), in the pictures only: 155 on Top Layer, 78 on Bottom Layer

## Text on the board
Bottom Silkscreen Layer: PA2 | PB3 | PB4 | PA1 | WKUP | PB5 | RST | PB6 | PB7 | PC13 | BAT | PB0 | PB9 | PB1 | PB8 | PB12 | PA7 | PB13 | PA6 | PB14 | PA5 | PB15 | PA4 | PA8 | PA9 | PA11 | PA12 | PA10 | GND | 5V | 3V3
Top Silkscreen Layer: 3V3 | GND | RST | CLK | SWDIO
